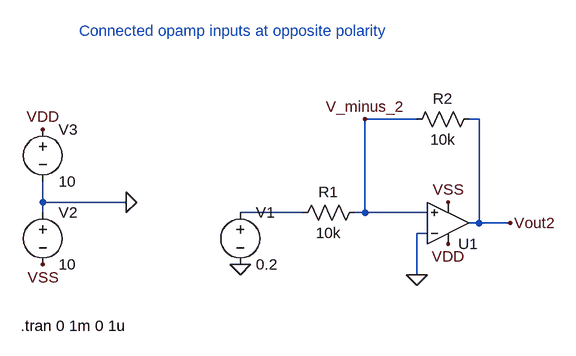
[diagram p0: schematic Inverting config 2.asc]
Inverting config 2.asc, the LTspice schematic file:
Version 4
SHEET 1 880 680
WIRE 288 -48 208 -48
WIRE 384 -48 368 -48
WIRE -288 80 -288 48
WIRE -160 80 -288 80
WIRE -288 96 -288 80
WIRE 112 96 16 96
WIRE 208 96 208 -48
WIRE 208 96 192 96
WIRE 304 96 208 96
WIRE 384 112 384 -48
WIRE 384 112 368 112
WIRE 432 112 384 112
WIRE 304 128 288 128
WIRE 288 192 288 128
FLAG 288 192 0
FLAG 16 176 0
FLAG 432 112 Vout2
FLAG -160 80 0
FLAG -288 -32 VDD
FLAG 336 144 VDD
FLAG -288 176 VSS
FLAG 336 80 VSS
FLAG 208 -48 V_minus_2
SYMBOL res 208 80 R90
WINDOW 0 0 56 VBottom 2
WINDOW 3 32 56 VTop 2
SYMATTR InstName R1
SYMATTR Value 10k
SYMBOL res 384 -64 R90
WINDOW 0 0 56 VBottom 2
WINDOW 3 32 56 VTop 2
SYMATTR InstName R2
SYMATTR Value 10k
SYMBOL voltage 16 80 R0
WINDOW 123 0 0 Left 0
WINDOW 39 0 0 Left 0
SYMATTR InstName V1
SYMATTR Value 0.2
SYMBOL Opamps\\UniversalOpamp2 336 112 M180
SYMATTR InstName U1
SYMBOL voltage -288 80 R0
WINDOW 123 0 0 Left 0
WINDOW 39 0 0 Left 0
SYMATTR InstName V2
SYMATTR Value 10
SYMBOL voltage -288 -48 R0
WINDOW 123 0 0 Left 0
WINDOW 39 0 0 Left 0
SYMATTR InstName V3
SYMATTR Value 10
TEXT -232 -184 Left 2 ;Connected opamp inputs at opposite polarity
TEXT -322 270 Left 2 !.tran 0 1m 0 1u

The netlist it stands for:
* Inverting config 2.asc
R1 V_minus_2 N001 10k
R2 Vout2 V_minus_2 10k
V1 N001 0 0.2
XU1 V_minus_2 0 VDD VSS Vout2 level.2 Avol=1Meg GBW=10Meg Slew=10Meg ilimit=25m rail=0 Vos=0 phimargin=45 en=0 enk=0 in=0 ink=0 Rin=500Meg  ; pins IN+ IN- V+ V- OUT
V2 0 VSS 10
V3 VDD 0 10
* Connected opamp inputs at opposite polarity
.tran 0 1m 0 1u
.lib UniversalOpamps2.sub
.backanno
.end